# Altium schematic sheet OCP.SchDoc
size A4; SheetNumber: 7; SheetTotal: 7
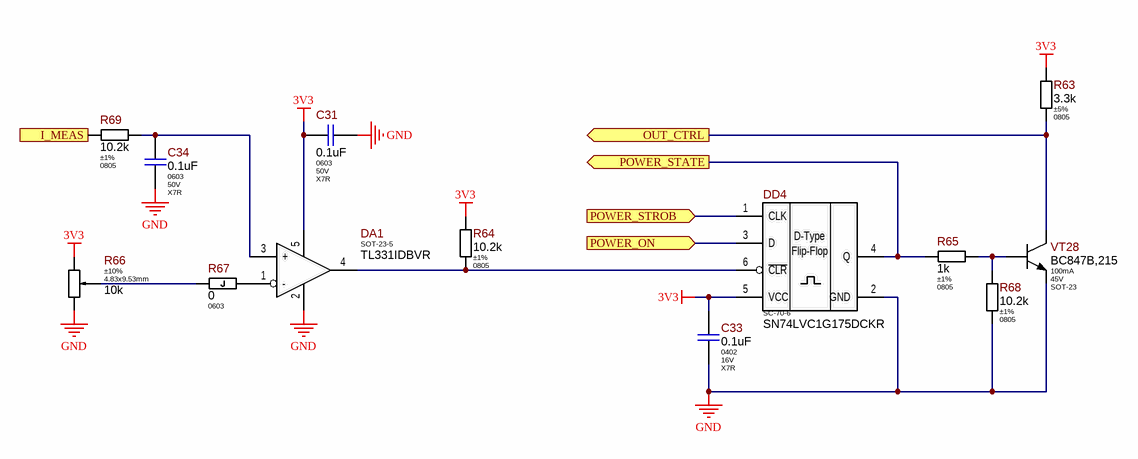
[diagram p0: OCP.SchDoc]

## Parts
C31  Package: 0603  Voltage: 50V  Dielectric Type: X7R  [C_CERAMIC_0603_MED]  (hidden comment: 0.1uF)
C33  Package: 0402  Voltage: 16V  Dielectric Type: X7R  [C_CERAMIC_0402_MED]  (hidden comment: 0.1uF)
C34  Package: 0603  Voltage: 50V  Dielectric Type: X7R  [C_CERAMIC_0603_MED]  (hidden comment: 0.1uF)
DA1  TL331IDBVR  [SOT-23-5]
DD4  SN74LVC1G175DCKR  [SC-70-6]
R63  Tolerance: ±5%  Package: 0805  [R_ANY_CHIP_0805_MED]  (hidden comment: 3.3k)
R64  Tolerance: ±1%  Package: 0805  [R_ANY_CHIP_0805_MED]  (hidden comment: 10.2k)
R65  Tolerance: ±1%  Package: 0805  [R_ANY_CHIP_0805_MED]  (hidden comment: 1k)
R66  Tolerance: ±10%  Package: 4.83x9.53mm  [3296W-1-xxx]  (hidden comment: 10k)
R67  Package: 0603  [R_ANY_CHIP_0603_MED]  (hidden comment: 0)
R68  Tolerance: ±1%  Package: 0805  [R_ANY_CHIP_0805_MED]  (hidden comment: 10.2k)
R69  Tolerance: ±1%  Package: 0805  [R_ANY_CHIP_0805_MED]  (hidden comment: 10.2k)
VT28  Part Number: BC847B,215  Ic: 100mA  Vce: 45V  Package: SOT-23  [SOT-23_MED]  (hidden comment: BC847B)

## Ports
I_MEAS (out), OUT_CTRL (out), POWER_ON (in), POWER_STATE (out), POWER_STROB (in)

## Nets
3V3: C31.2 C33.1 DA1.5(VCC) DD4.5(VCC) R63.1 R64.2 R66.1(CCW)
GND: C31.1 C33.2 C34.2 DA1.2(GND) DD4.2(GND) R66.3(CW) R68.1 VT28.2(E)
I_MEAS: R69.2 ; port I_MEAS
OUT_CTRL: R63.2 VT28.3(C) ; port OUT_CTRL
POWER_ON: DD4.3(D) ; port POWER_ON
POWER_STATE: DD4.4(Q) R65.1 ; port POWER_STATE
POWER_STROB: DD4.1(CLK) ; port POWER_STROB
NetC34_1: C34.1 DA1.3(+) R69.1
NetDA1_1: DA1.1(-) R67.1
NetDA1_4: DA1.4(OUT) DD4.6(~{CLR}) R64.1
NetR65_2: R65.2 R68.2 VT28.1(B)
NetR66_2: R66.2(WIPER) R67.2

## Notes on the sheet
- (in symbol SN74LVC1G175DCKR) D-Type; Flip-Flop

## Library data of the parts
C31 C34 = CL10B104KB8NNND: 100nF 50V X7R ±10% 0603 Ceramic Capacitor RoHS; Manufacturer: Samsung Electro-Mechanics; Ajax_1C_ID: 21313; Ajax_1C_PN: 100nF 50V X7R 10% 0603 CL10B104KB8NNND ceramic capacitor SMD; Ajax_1С_Status: Substitution; Standard Lead Time: 18 Weeks; Component Status: Released; Replacement: CL10B104KB8NNNC; GUID_1C: f1fd6399-ca68-11ea-ab63-0050569f2651; Value: 0.1uF; Part Number: CL10B104KB8NNND; Part Type: Ceramic / X7R / 0603; Component Type: SMD; Temperature Range: -55°C ~ 125°C; Tolerance: ±10%; ComponentLink1URL: https://media.digikey.com/pdf/Data%20Sheets/Samsung%20PDFs/CL_Series_MLCC_ds.pdf; Supplier 1: Digi-Key; Supplier Part Number 1: CL10B104KB8NNND-ND; Price: 0,0039378; ComponentLink1Description: Datasheet
C33 = CC0402KPX7R7BB104: 100nF 16V X7R ±10% 0402 Ceramic Capacitor RoHS; Manufacturer: Yageo; Ajax_1C_ID: 24373; Ajax_1C_PN: 100nF 16V X7R 10% 0402 CC0402KPX7R7BB104 Ceramic Capacitor SMD RoHS; Standard Lead Time: 20 Weeks; Replacement: CC0402KRX7R7BB104; Ajax_1С_Status: Mass Production; Component Status: Released; GUID_1C: f08a0794-308d-11eb-ab6e-0050569f2651; Value: 0.1uF; Part Number: CC0402KPX7R7BB104; Part Type: Ceramic / X7R / 0402; Component Type: SMD; Temperature Range: -55°C ~ 125°C; Tolerance: ±10%; ComponentLink1URL: https://eu.mouser.com/datasheet/2/447/UPY_NP0X5R_01005_4V_to_25V_V10-3003057.pdf; Supplier 1: Mouser; Supplier Part Number 1: 603-CC402KPX7R7BB104; ComponentLink1Description: Datasheet; Price: 0.0013
DA1 = TL331IDBVR: Up to 36V, Single Comparator, Open Collector Output, 700uA Supply Current, SOT-23-5; Manufacturer: Texas Instruments; Ajax_1C_PN: NONE; Ajax_1С_Status: RND Only; Standard Lead Time: 45 Weeks; Component Status: Released; Package: SOT-23-5; Part Number: TL331IDBVR; Part Type: Comparator; Component Type: SMD; Temperature Range: -40°C ~ 105°C; ComponentLink1URL: https://www.ti.com/lit/ds/symlink/tl391b.pdf; Supplier 1: Mouser; Supplier Part Number 1: 595-TL331IDBVR; Replacement: NONE; Price: NONE; ComponentLink1Description: Datasheet
DD4 = SN74LVC1G175DCKR: Single D-type Flip-Flop with Asynchronous Clear, Positive Edge Trigger, SC-70-6; Manufacturer: Texas Instruments; Ajax_1C_ID: 25389; Ajax_1C_PN: SN74LVC1G175DCKR (SC70-6) микросхема; Standard Lead Time: 6 Weeks; Replacement: NONE; Ajax_1С_Status: RND Only; Component Status: Released; GUID_1C: 0fcd2c69-53fe-11eb-ab6e-0050569f2651; Package: SC-70-6; Part Number: SN74LVC1G175DCKR; Part Type: Logic / Flip-Flop; Component Type: SMD; Temperature Range: -40°C ~ 125°C; ComponentLink1URL: https://www.ti.com/lit/ds/symlink/sn74lvc1g175.pdf; Supplier 1: Digi-Key; Supplier Part Number 1: 296-16998-2-ND; ComponentLink1Description: Datasheet; Price: 0,0382
R63 = RC0805JR-073K3L: 3.3 kOhms ±5%, 1/8W 0805 Thick Film Resistor; Manufacturer: Yageo; Ajax_1C_ID: 9030; Ajax_1C_PN: 3.3k 5% 0805 Resistors SMD RoHS; Ajax_1С_Status: RND Only; Power Rating: 0.125W; Voltage: 150V; Component Status: Released; Temperature Stability: ±100ppm/°C; Replacement: NONE; GUID_1C: cb9785ec-9b47-11e6-8242-d8cb8a9acc66; Value: 3.3k; Part Number: RC0805JR-073K3L; Component Type: SMD; Part Type: Thick Film; Temperature Range: -55°C ~ 155°C; ComponentLink1URL: https://eu.mouser.com/datasheet/2/447/PYu_RC_Group_51_RoHS_L_10-1664068.pdf; Price: 0,001081; ComponentLink1Description: Datasheet
R64 R68 R69 = RC0805FR-0710K2L: 10.2 kOhms ±1%, 1/8W 0805 Thick Film Resistor; Manufacturer: Yageo; Ajax_1C_ID: 13943; Ajax_1C_PN: 10.2k 1% 0805 Resistors SMD RoHS; Ajax_1С_Status: Mass Production; Power Rating: 0.125W; Voltage: 150V; Component Status: Released; Temperature Stability: ±100ppm/°C; Replacement: NONE; GUID_1C: 8bc9d0ce-c58a-11e8-ab47-0050569f2651; Value: 10.2k; Part Number: RC0805FR-0710K2L; Component Type: SMD; Part Type: Thick Film; Temperature Range: -55°C ~ 155°C; ComponentLink1URL: https://eu.mouser.com/datasheet/2/447/PYu_RC_Group_51_RoHS_L_10-1664068.pdf; Supplier 1: Digi-Key; Supplier Part Number 1: 311-10.2KCRTR-ND; Price: 0,0014; ComponentLink1Description: Datasheet
R65 = RC0805FR-0710K2L: 1 kOhms ±1%, 1/8W 0805 Thick Film Resistor; Manufacturer: Yageo; Ajax_1C_ID: 13943; Ajax_1C_PN: 10.2k 1% 0805 Resistors SMD RoHS; Ajax_1С_Status: Mass Production; Power Rating: 0.125W; Voltage: 150V; Component Status: Released; Temperature Stability: ±100ppm/°C; Replacement: NONE; GUID_1C: 8bc9d0ce-c58a-11e8-ab47-0050569f2651; Value: 1k; Part Number: RC0805FR-0710K2L; Component Type: SMD; Part Type: Thick Film; Temperature Range: -55°C ~ 155°C; ComponentLink1URL: https://eu.mouser.com/datasheet/2/447/PYu_RC_Group_51_RoHS_L_10-1664068.pdf; Supplier 1: Digi-Key; Supplier Part Number 1: 311-10.2KCRTR-ND; Price: 0,0014; ComponentLink1Description: Datasheet
R66 = 3296W-1-103LF: 10 kOhms ±10% Trimmer Resistor, 0.5W, Through Hole 3/8", 4.83x9.53mm, 10.03mm Height; Manufacturer: Bourns; Ajax_1C_PN: NONE; Ajax_1С_Status: RND Only; Component Status: On Review; Temperature Stability: ±100ppm/°C; Value: 10k; Part Number: 3296W-1-103LF; Component Type: PTH; Part Type: Trimming Potentiometer; Power Rating: 0.5W; Temperature Range: -55°C ~ 125°C; ComponentLink1URL: https://www.bourns.com/data/global/pdfs/3296.pdf; Supplier 1: Mouser; Supplier Part Number 1: 652-3296W-1-103LF; Replacement: NONE; Price: NONE; ComponentLink1Description: Datasheet
R67 = RC0603JR-070RL: 0 Ohms Jumper, 1/10W 0603 Thick Film Resistor; Manufacturer: Yageo; Tolerance: ±5%; Ajax_1C_ID: 2857; Ajax_1C_PN: 0R 5% 0603 Resistors SMD RoHS; Ajax_1С_Status: Mass Production; Power Rating: 0.1W; Voltage: 75V; Component Status: Released; Temperature Stability: NONE; GUID_1C: df4c284c-e567-11e2-9779-6c626deda1bb; Value: 0; Part Number: RC0603JR-070RL; Component Type: SMD; Part Type: Thick Film; Temperature Range: -55°C ~ 155°C; ComponentLink1URL: https://eu.mouser.com/datasheet/2/447/PYu_RC_Group_51_RoHS_L_10-1664068.pdf; Supplier 1: Digi-Key; Supplier Part Number 1: 311-0.0GRTR-ND; Replacement: NONE; Price: 0,0006; ComponentLink1Description: Datasheet
VT28 = BC847B,215: 45V, 100mA NPN General Purpose Transistor; Manufacturer: Nexperia USA; Ajax_1C_PN: BC847B,215 transistor; Standard Lead Time: 4 Weeks; Replacement: NONE; Ajax_1C_ID: 32205; Ajax_1С_Status: RND Only; Component Status: Released; GUID_1C: d2f86895-eaea-11eb-ab74-0050569f2651; Part Type: NPN; Component Type: SMD; Temperature Range: -65°C ~ 150°C; ComponentLink1URL: https://assets.nexperia.com/documents/data-sheet/BC847_SER.pdf; Supplier 1: Digi-Key; Supplier Part Number 1: 1727-2921-2-ND; ComponentLink1Description: Datasheet; Price: 0,069